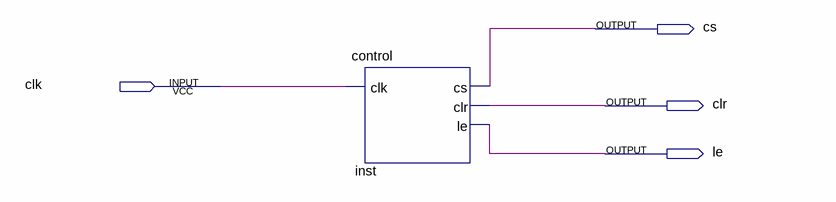
[diagram p0: schematic sheet]
// Quartus schematic control1.bdf as structural Verilog: 1 symbols, 4 pins
module control1 (
  input  clk,
  output cs,
  output clr,
  output le
);

  control inst (.clk(clk), .cs(cs), .clr(clr), .le(le));
endmodule
